# Altium project mapaSensorChassi.PrjPCB
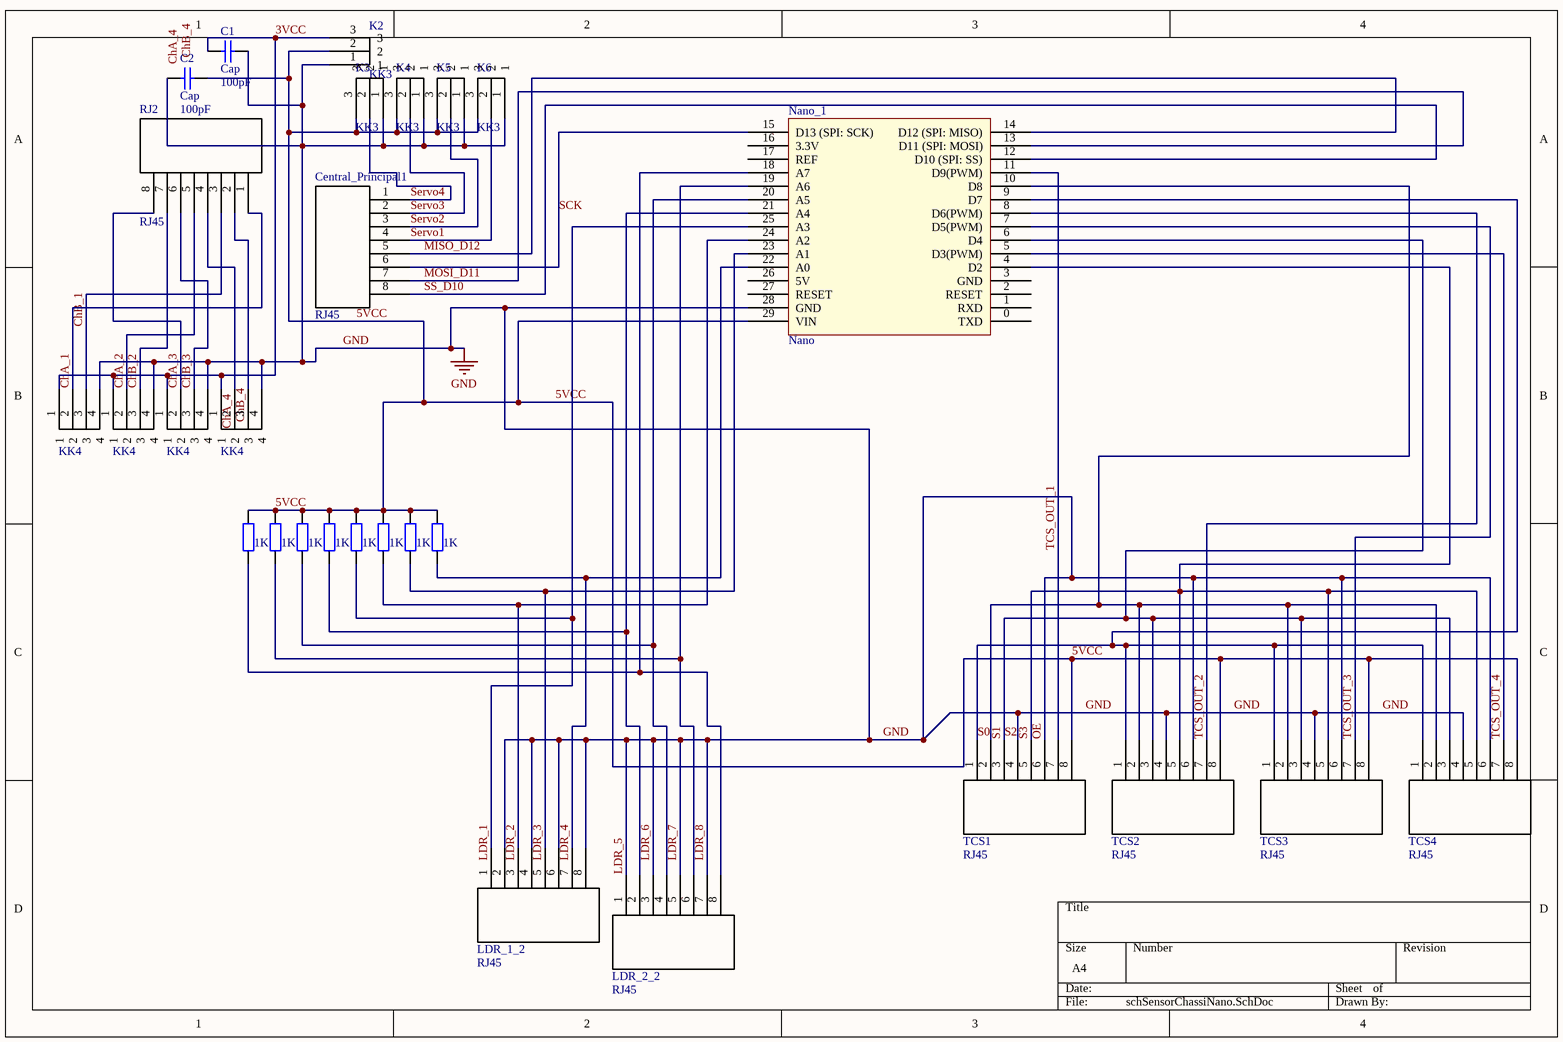
[diagram p0: schSensorChassiNano.SchDoc]
4 sheets, 110 parts. Net scope: global (net labels, ports and power ports of the same name join across sheets).
Board files: pcbSensorChassiNano.PcbDoc, pcbGarra.PcbDoc, pcbChaves.PcbDoc
Sheets:
  schSensorChassiNano.SchDoc
  schBeagleBone.SchDoc
  schGarra.SchDoc
  schChaves.SchDoc

## Sheet schSensorChassiNano.SchDoc
size A4

### Parts
C1  Cap  value 100pF  [RAD-0.3]
C2  Cap  value 100pF  [RAD-0.3]
Central_Principal1  RJ45  [RJ45_90]
Encoder_4  KK4  [4-vias]
Encoder_5  KK4  [4-vias]
Encoder_6  KK4  [4-vias]
K1  KK4  [4-vias]
K2  KK3  [3-vias]
K3  KK3  [3-vias]
K4  KK3  [3-vias]
K5  KK3  [3-vias]
K6  KK3  [3-vias]
LDR_1_2  RJ45  [RJ45_90]
LDR_2_2  RJ45  [RJ45_90]
Nano_1  Nano  [Arduino_Nano]
R17  value 1K  [AXIAL-0.4]  (hidden comment: Res2)
R18  value 1K  [AXIAL-0.4]  (hidden comment: Res2)
R19  value 1K  [AXIAL-0.4]  (hidden comment: Res2)
R20  value 1K  [AXIAL-0.4]  (hidden comment: Res2)
R21  value 1K  [AXIAL-0.4]  (hidden comment: Res2)
R22  value 1K  [AXIAL-0.4]  (hidden comment: Res2)
R23  value 1K  [AXIAL-0.4]  (hidden comment: Res2)
R24  value 1K  [AXIAL-0.4]  (hidden comment: Res2)
RJ2  RJ45  [RJ45_90]
TCS1  RJ45  [RJ45_90]
TCS2  RJ45  [RJ45_90]
TCS3  RJ45  [RJ45_90]
TCS4  RJ45  [RJ45_90]

### Nets
GND: C1.2 C2.1 Encoder_4.4 Encoder_5.4 Encoder_6.4 K1.4 K2.1 K3.1 K4.1 K5.1 K6.1 LDR_1_2.2 LDR_1_2.4 LDR_1_2.6 LDR_1_2.8 LDR_2_2.1 LDR_2_2.3 LDR_2_2.5 LDR_2_2.7 Nano_1.28(GND) TCS1.4 TCS1.6 TCS2.4 TCS2.6 TCS3.4 TCS3.6 TCS4.4 TCS4.6  [also labelled LDR_5, LDR_6, LDR_7, LDR_8, OE]  [project net 12V]
3VCC: C1.1 Encoder_4.1 Encoder_5.1 Encoder_6.1 K1.1 K2.3
5VCC: C2.2 K2.2 K3.3 K4.3 K5.3 K6.3 Nano_1.29(VIN) R17.2 R18.2 R19.2 R20.2 R21.2 R22.2 R23.2 R24.2 TCS1.8 TCS2.8 TCS3.8 TCS4.8
ChA_1: K1.2 RJ2.1
ChA_2: Encoder_4.2 RJ2.5
ChA_3: Encoder_5.2 RJ2.8
ChB_1: K1.3 RJ2.3
ChB_2: Encoder_4.3 RJ2.7
ChB_3: Encoder_5.3 RJ2.6
MISO_D12: Central_Principal1.5 Nano_1.14(D12_(SPI:_MISO))
MOSI_D11: Central_Principal1.7 Nano_1.13(D11_(SPI:_MOSI))
S0: Nano_1.9(D7) TCS1.1 TCS2.1 TCS3.1 TCS4.1
S1: Nano_1.6(D4) TCS1.3 TCS2.3 TCS3.3 TCS4.3  [also labelled S2]
S3: Nano_1.4(D2) TCS1.5 TCS2.5 TCS3.5 TCS4.5
SCK: Central_Principal1.6 Nano_1.15(D13_(SPI:_SCK))
Servo1: Central_Principal1.4 K6.2
Servo2: Central_Principal1.3 K5.2
Servo3: Central_Principal1.2 K4.2
Servo4: Central_Principal1.1 K3.2
SS_D10: Central_Principal1.8 Nano_1.12(D10_(SPI:_SS))
TCS_OUT_1: Nano_1.11(D9(PWM)) TCS1.7
TCS_OUT_2: Nano_1.8(D6(PWM)) TCS2.7
TCS_OUT_3: Nano_1.7(D5(PWM)) TCS3.7
TCS_OUT_4: Nano_1.5(D3(PWM)) TCS4.7
NetEncoder_6_2: Encoder_6.2 RJ2.4
NetEncoder_6_3: Encoder_6.3 RJ2.2
NetLDR_1_2_1: LDR_1_2.1 Nano_1.25(A3) R21.1
NetLDR_1_2_3: LDR_1_2.3 Nano_1.24(A2) R22.1
NetLDR_1_2_5: LDR_1_2.5 Nano_1.23(A1) R23.1
NetLDR_1_2_7: LDR_1_2.7 Nano_1.22(A0) R24.1
NetLDR_2_2_2: LDR_2_2.2 Nano_1.21(A4) R20.1
NetLDR_2_2_4: LDR_2_2.4 Nano_1.20(A5) R19.1
NetLDR_2_2_6: LDR_2_2.6 Nano_1.19(A6) R18.1
NetLDR_2_2_8: LDR_2_2.8 Nano_1.18(A7) R17.1
NetNano_1_10: Nano_1.10(D8) TCS1.2 TCS2.2 TCS3.2 TCS4.2

Not connected (* = marked no-connect by the designer): Nano_1 0(TXD) 1(RXD) 2(RESET) 3(GND) 16(3.3V) 17(REF) 26(5V) 27(RESET)

### Notes on the sheet
- Labels drawn without touching a wire or pin: ChA_4, ChB_4, LDR_1, LDR_2, LDR_3, LDR_4

### Library data of the parts
C1 C2 = Cap: Capacitor; Published: 8-Jun-2000; LatestRevisionDate: 17-Jul-2002; LatestRevisionNote: Re-released for DXP Platform.; PackageReference: RAD-0.3; Publisher: Altium Limited; PackageDescription: Radial Cap, Thru-Hole; 2 Leads; 0.3 in Pin Spacing
Encoder_4-Encoder_6 K1 = KK4Vias: ComponentLink1Description: Fabricante; ComponentLink1URL: https://www.molex.com/molex/products/family?key=kk_254_rpc_connector_system&channel=products&chanName=family&pageTitle=Introduction&parentKey=kk_interconnect_solutions
K2-K6 = KK3Vias
Nano_1 = Arduino_Nano
R17-R24 = Res2: Resistor; Published: 8-Jun-2000; LatestRevisionDate: 17-Jul-2002; LatestRevisionNote: Re-released for DXP Platform.; PackageReference: AXIAL-0.4; Publisher: Altium Limited; PackageDescription: Axial Device, Thru-Hole; 2 Leads; 0.4 in Pin Spacing

## Sheet schBeagleBone.SchDoc
size A4
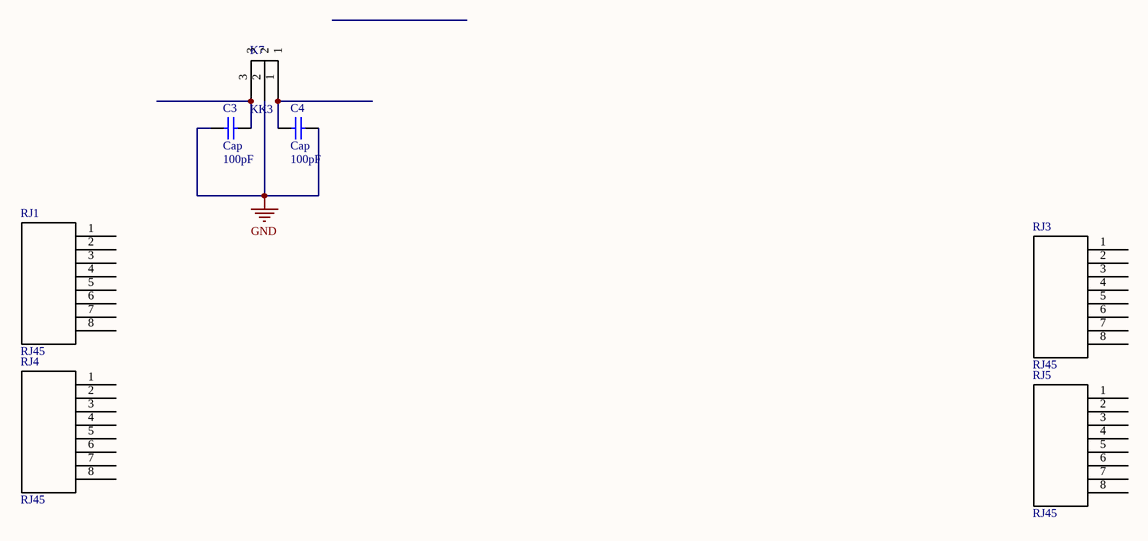
[diagram p1: schBeagleBone.SchDoc]

### Parts
C3  Cap  value 100pF  [RAD-0.3]
C4  Cap  value 100pF  [RAD-0.3]
K7  KK3  [3-vias]
RJ1  RJ45  [RJ45_90]
RJ3  RJ45  [RJ45_Simples]
RJ4  RJ45  [RJ45_90]
RJ5  RJ45  [RJ45_Simples]

### Nets
GND: C3.1 C4.2 K7.2  [project net 12V]
NetC3_2: C3.2 K7.3
NetC4_1: C4.1 K7.1

Not connected (* = marked no-connect by the designer): RJ1 1(9) 2 3 4 5 6 7 8; RJ3 1(9) 2 3 4 5 6 7 8; RJ4 1(9) 2 3 4 5 6 7 8; RJ5 1(9) 2 3 4 5 6 7 8

### Library data of the parts
C3 C4 = Cap: Capacitor; Published: 8-Jun-2000; LatestRevisionDate: 17-Jul-2002; LatestRevisionNote: Re-released for DXP Platform.; PackageReference: RAD-0.3; Publisher: Altium Limited; PackageDescription: Radial Cap, Thru-Hole; 2 Leads; 0.3 in Pin Spacing
K7 = KK3Vias
RJ1 RJ4 = RJ45_90

## Sheet schGarra.SchDoc
size A4
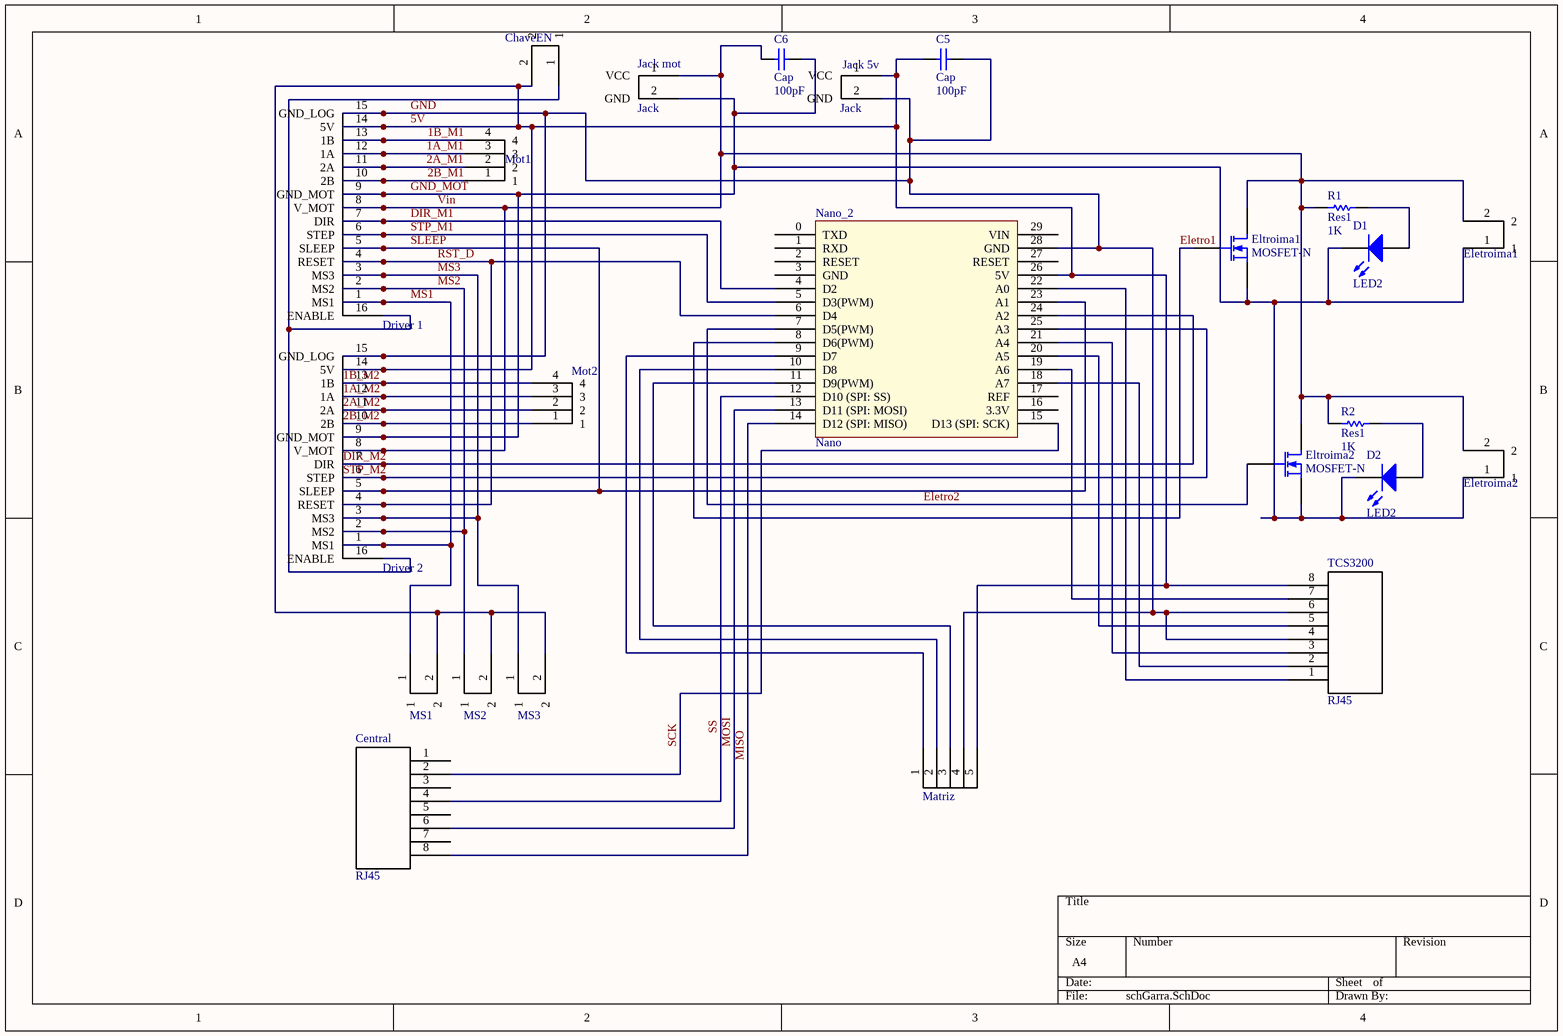
[diagram p2: schGarra.SchDoc]

### Parts
C5  Cap  value 100pF  [RAD-0.3]
C6  Cap  value 100pF  [RAD-0.3]
Central  RJ45  [RJ45_Simples]
ChaveEN  KK2  [2-vias]  (value not drawn)
D1  LED2  [2-vias]
D2  LED2  [2-vias]
Driver_1  A4988  [A4988]  (value not drawn)
Driver_2  A4988  [A4988]  (value not drawn)
Eletroima1  KK2  [2-vias]  (value not drawn)
Eletroima2  KK2  [2-vias]  (value not drawn)
Eltroima1  MOSFET-N  [3-vias]
Eltroima2  MOSFET-N  [3-vias]
Jack_5v  Jack  [JACK J4]
Jack_mot  Jack  [JACK J4]
Matriz  JTS-XH (5T)  [JTS-XH (5T)]  (value not drawn)
Mot1  KK4  [4-vias]  (value not drawn)
Mot2  KK4  [4-vias]  (value not drawn)
MS1  KK2  [2-vias]  (value not drawn)
MS2  KK2  [2-vias]  (value not drawn)
MS3  KK2  [2-vias]  (value not drawn)
Nano_2  Nano  [Arduino_Nano]
R1  Res1  value 1K  [AXIAL-0.3]
R2  Res1  value 1K  [AXIAL-0.3]
TCS3200  RJ45  [RJ45_Simples]

### Nets
GND: C5.2 Driver_1.15(GND_LOG) Driver_2.15(GND_LOG) Jack_5v.2(GND) Matriz.4 Nano_2.28(GND) TCS3200.4 TCS3200.6  [project net 12V]
1A_M1: Driver_1.12(1A) Mot1.3
1A_M2: Driver_2.12(1A) Mot2.3
1B_M1: Driver_1.13(1B) Mot1.4
1B_M2: Driver_2.13(1B) Mot2.4
2A_M1: Driver_1.11(2A) Mot1.2
2A_M2: Driver_2.11(2A) Mot2.2
2B_M1: Driver_1.10(2B) Mot1.1
2B_M2: Driver_2.10(2B) Mot2.1
5V: C5.1 ChaveEN.2 Driver_1.14(5V) Driver_2.14(5V) Jack_5v.1(VCC) Matriz.5 MS1.2 MS2.2 MS3.2 Nano_2.26(5V) TCS3200.8
DIR_M1: Driver_1.7(DIR) Nano_2.4(D2)
DIR_M2: Driver_2.7(DIR) Nano_2.24(A2)
Eletro1: Eltroima1.2(G) Nano_2.8(D6(PWM))
Eletro2: Eltroima2.2(G) Nano_2.7(D5(PWM))
GND_MOT: C6.2 D1.2(K) D2.2(K) Driver_1.9(GND_MOT) Driver_2.9(GND_MOT) Eletroima1.1 Eletroima2.1 Eltroima1.3(S) Eltroima2.3(S) Jack_mot.2(GND)
MISO: Central.8 Nano_2.14(D12_(SPI:_MISO))
MOSI: Central.6 Nano_2.13(D11_(SPI:_MOSI))
MS1: Driver_1.1(MS1) Driver_2.1(MS1) MS1.1
MS2: Driver_1.2(MS2) Driver_2.2(MS2) MS2.1
MS3: Driver_1.3(MS3) Driver_2.3(MS3) MS3.1
RST_D: Driver_1.4(RESET) Driver_2.4(RESET) Nano_2.6(D4)
SCK: Central.2 Nano_2.15(D13_(SPI:_SCK))
SLEEP: Driver_1.5(SLEEP) Driver_2.5(SLEEP) Nano_2.23(A1)
SS: Central.4 Nano_2.12(D10_(SPI:_SS))
STP_M1: Driver_1.6(STEP) Nano_2.5(D3(PWM))
STP_M2: Driver_2.6(STEP) Nano_2.25(A3)
Vin: C6.1 Driver_1.8(V_MOT) Driver_2.8(V_MOT) Eletroima1.2 Eletroima2.2 Eltroima1.1(D) Eltroima2.1(D) Jack_mot.1(VCC) R1.2 R2.1
NetChaveEN_1: ChaveEN.1 Driver_1.16(ENABLE) Driver_2.16(ENABLE)
NetD1_1: D1.1(A) R1.1
NetD2_1: D2.1(A) R2.2
NetMatriz_1: Matriz.1 Nano_2.9(D7)
NetMatriz_2: Matriz.2 Nano_2.10(D8)
NetMatriz_3: Matriz.3 Nano_2.11(D9(PWM))
NetNano_2_18: Nano_2.18(A7) TCS3200.2
NetNano_2_19: Nano_2.19(A6) TCS3200.7
NetNano_2_20: Nano_2.20(A5) TCS3200.5
NetNano_2_21: Nano_2.21(A4) TCS3200.3
NetNano_2_22: Nano_2.22(A0) TCS3200.1

Not connected (* = marked no-connect by the designer): Central 1(9) 3 5 7; Nano_2 0(TXD) 1(RXD) 2(RESET) 3(GND) 16(3.3V) 17(REF) 27(RESET) 29(VIN)

### Library data of the parts
C5 C6 = Cap: Capacitor; Published: 8-Jun-2000; LatestRevisionDate: 17-Jul-2002; LatestRevisionNote: Re-released for DXP Platform.; PackageReference: RAD-0.3; Publisher: Altium Limited; PackageDescription: Radial Cap, Thru-Hole; 2 Leads; 0.3 in Pin Spacing
ChaveEN Eletroima1 Eletroima2 MS1-MS3 = KK2Vias
D1 D2 = LED2: Typical RED, GREEN, YELLOW, AMBER GaAs LED; Published: 8-Jun-2000; LatestRevisionDate: 17-Jul-2002; LatestRevisionNote: Re-released for DXP Platform.; PackageVersion: Feb-2002; PackageReference: 3.2X1.6X1.1; Publisher: Altium Limited; PackageDescription: SM LED; 2 Flat Leads
Eltroima1 Eltroima2 = MOSFET-N: N-Channel MOSFET; Published: 8-Jun-2000; LatestRevisionDate: 17-Jul-2002; LatestRevisionNote: Re-released for DXP Platform.; PackageVersion: 1995/1996; PackageReference: E3; Publisher: Altium Limited; PackageDescription: TO, Flat Index; 3 In-Line, Axial Leads; Body Dia. 4.6mm; Lead Dia. 0.5 mm (max)
Mot1 Mot2 = KK4Vias: ComponentLink1Description: Fabricante; ComponentLink1URL: https://www.molex.com/molex/products/family?key=kk_254_rpc_connector_system&channel=products&chanName=family&pageTitle=Introduction&parentKey=kk_interconnect_solutions
Nano_2 = Arduino_Nano
R1 R2 = Res1: Resistor; Published: 8-Jun-2000; LatestRevisionDate: 17-Jul-2002; LatestRevisionNote: Re-released for DXP Platform.; PackageReference: AXIAL-0.3; Publisher: Altium Limited; PackageDescription: Axial Device, Thru-Hole; 2 Leads; 0.3 in Pin Spacing

## Sheet schChaves.SchDoc
size A4
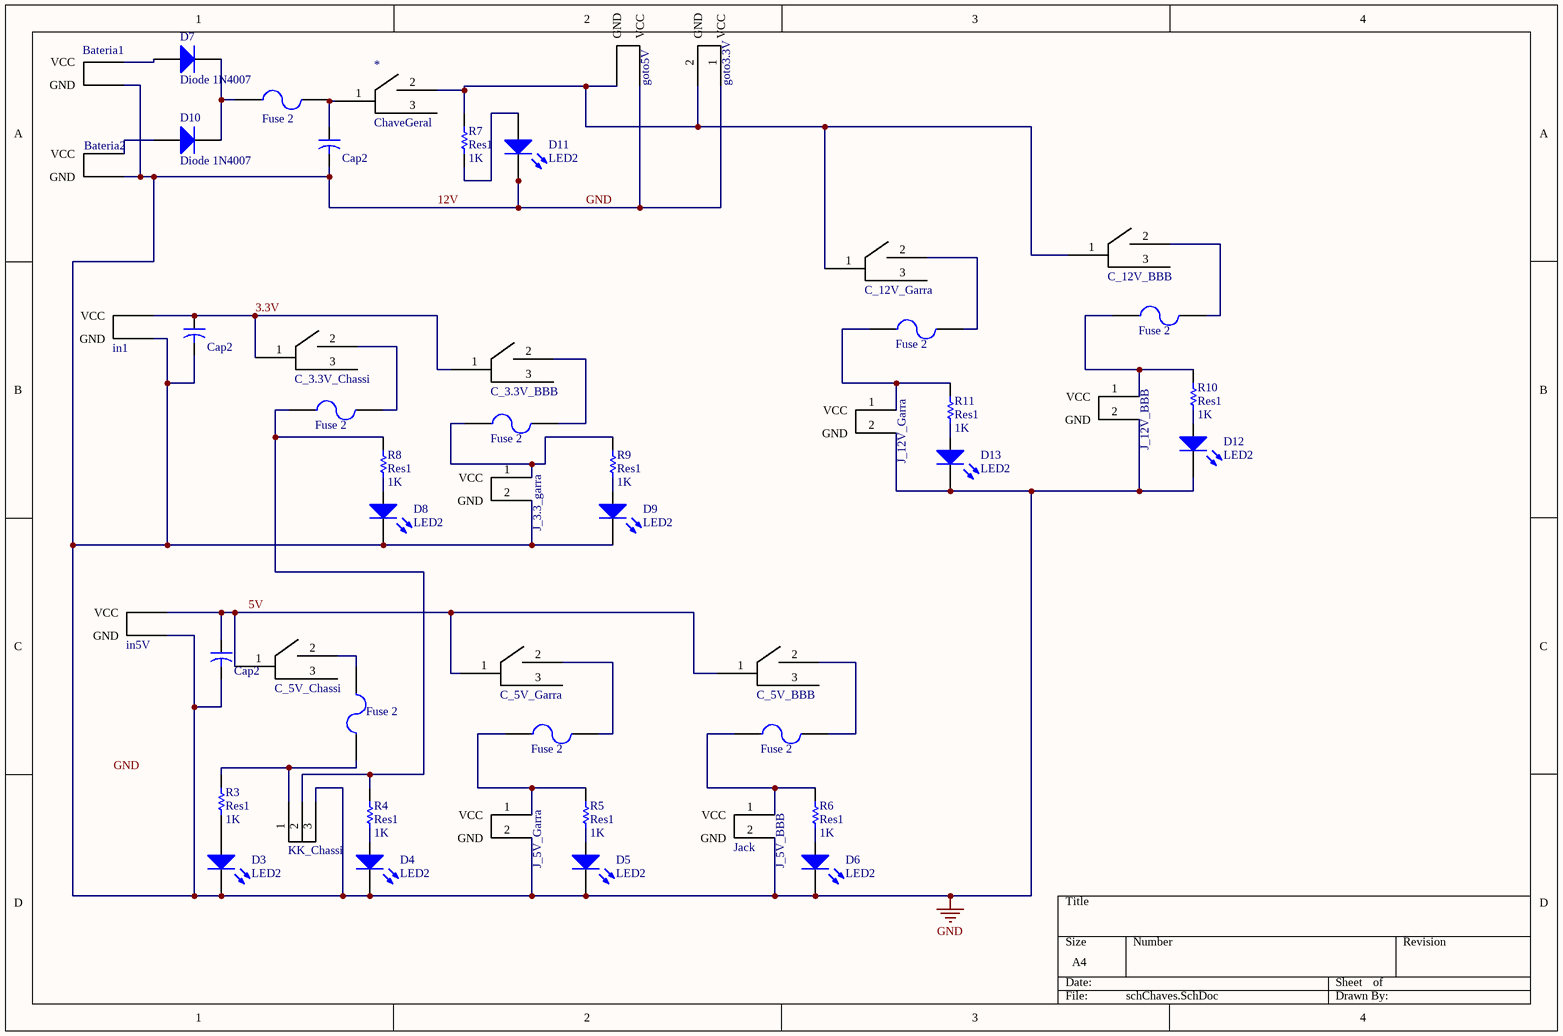
[diagram p3: schChaves.SchDoc]

### Parts
*  ChaveGeral  [Chave]
Bateria1  Jack  [JACK J4]  (value not drawn)
Bateria2  Jack  [JACK J4]  (value not drawn)
C_3.3V_BBB  Chave  [Chave]  (value not drawn)
C_3.3V_Chassi  Chave  [Chave]  (value not drawn)
C_5V_BBB  Chave  [Chave]  (value not drawn)
C_5V_Chassi  Chave  [Chave]  (value not drawn)
C_5V_Garra  Chave  [Chave]  (value not drawn)
C_12V_BBB  Chave  [Chave]  (value not drawn)
C_12V_Garra  Chave  [Chave]  (value not drawn)
C_parrudo  Cap2  [CAPR5-4X5]
C_parrudo1  Cap2  [CAPR5-4X5]
C_parrudo2  Cap2  [CAPR5-4X5]
D3  LED2  [2-vias]
D4  LED2  [2-vias]
D5  LED2  [2-vias]
D6  LED2  [2-vias]
D7  Diode 1N4007  [DO-41]
D8  LED2  [2-vias]
D9  LED2  [2-vias]
D10  Diode 1N4007  [DO-41]
D11  LED2  [2-vias]
D12  LED2  [2-vias]
D13  LED2  [2-vias]
F1  Fuse 2  [AXIAL-0.9]
F2  Fuse 2  [AXIAL-0.9]
F3  Fuse 2  [AXIAL-0.9]
F4  Fuse 2  [AXIAL-0.9]
F5  Fuse 2  [AXIAL-0.9]
F6  Fuse 2  [AXIAL-0.9]
F7  Fuse 2  [AXIAL-0.9]
F8  Fuse 2  [AXIAL-0.9]
goto3.3V  Jack  [JACK J4]  (value not drawn)
goto5V  Jack  [JACK J4]  (value not drawn)
in1  Jack  [JACK J4]  (value not drawn)
in5V  Jack  [JACK J4]  (value not drawn)
J_3.3_garra  Jack  [JACK J4]  (value not drawn)
J_5V_BBB  Jack  [JACK J4]
J_5V_Garra  Jack  [JACK J4]  (value not drawn)
J_12V_BBB  Jack  [JACK J4]  (value not drawn)
J_12V_Garra  Jack  [JACK J4]  (value not drawn)
KK_Chassi  KK3  [3-vias]  (value not drawn)
R3  Res1  value 1K  [AXIAL-0.3]
R4  Res1  value 1K  [AXIAL-0.3]
R5  Res1  value 1K  [AXIAL-0.3]
R6  Res1  value 1K  [AXIAL-0.3]
R7  Res1  value 1K  [AXIAL-0.3]
R8  Res1  value 1K  [AXIAL-0.3]
R9  Res1  value 1K  [AXIAL-0.3]
R10  Res1  value 1K  [AXIAL-0.3]
R11  Res1  value 1K  [AXIAL-0.3]

### Nets
12V: Bateria1.2(GND) Bateria2.2(GND) C_parrudo.2 C_parrudo1.2 C_parrudo2.2 D3.2(K) D4.2(K) D5.2(K) D6.2(K) D8.2(K) D9.2(K) D11.2(K) D12.2(K) D13.2(K) goto3.3V.1(VCC) goto5V.1(VCC) in1.2(GND) in5V.2(GND) J_3.3_garra.2(GND) J_5V_BBB.2(GND) J_5V_Garra.2(GND) J_12V_BBB.2(GND) J_12V_Garra.2(GND) KK_Chassi.3  [also labelled GND]
3.3V: C_3.3V_BBB.1(Comum) C_3.3V_Chassi.1(Comum) C_parrudo1.1 in1.1(VCC)
5V: C_5V_BBB.1(Comum) C_5V_Chassi.1(Comum) C_5V_Garra.1(Comum) C_parrudo2.1 in5V.1(VCC)
Net*_1: *.1(Comum) C_parrudo.1 F1.2
Net*_2: *.2(N.A.) C_12V_BBB.1(Comum) C_12V_Garra.1(Comum) goto3.3V.2(GND) goto5V.2(GND) R7.2
NetBateria1_1: Bateria1.1(VCC) D7.1(A)
NetBateria2_1: Bateria2.1(VCC) D10.1(A)
NetC_3.3V_BBB_2: C_3.3V_BBB.2(N.A.) F3.2
NetC_3.3V_Chassi_2: C_3.3V_Chassi.2(N.A.) F2.2
NetC_5V_BBB_2: C_5V_BBB.2(N.A.) F6.2
NetC_5V_Chassi_2: C_5V_Chassi.2(N.A.) F4.1
NetC_5V_Garra_2: C_5V_Garra.2(N.A.) F5.2
NetC_12V_BBB_2: C_12V_BBB.2(N.A.) F7.2
NetC_12V_Garra_2: C_12V_Garra.2(N.A.) F8.2
NetD3_1: D3.1(A) R3.1
NetD4_1: D4.1(A) R4.1
NetD5_1: D5.1(A) R5.1
NetD6_1: D6.1(A) R6.1
NetD7_2: D7.2(K) D10.2(K) F1.1
NetD8_1: D8.1(A) R8.1
NetD9_1: D9.1(A) R9.1
NetD11_1: D11.1(A) R7.1
NetD12_1: D12.1(A) R10.1
NetD13_1: D13.1(A) R11.1
NetF2_1: F2.1 KK_Chassi.2 R4.2 R8.2
NetF3_1: F3.1 J_3.3_garra.1(VCC) R9.2
NetF4_2: F4.2 KK_Chassi.1 R3.2
NetF5_1: F5.1 J_5V_Garra.1(VCC) R5.2
NetF6_1: F6.1 J_5V_BBB.1(VCC) R6.2
NetF7_1: F7.1 J_12V_BBB.1(VCC) R10.2
NetF8_1: F8.1 J_12V_Garra.1(VCC) R11.2

Not connected (* = marked no-connect by the designer): * 3(N.F); C_3.3V_BBB 3(N.F); C_3.3V_Chassi 3(N.F); C_5V_BBB 3(N.F); C_5V_Chassi 3(N.F); C_5V_Garra 3(N.F); C_12V_BBB 3(N.F); C_12V_Garra 3(N.F)

### Notes on the sheet
- Labels drawn without touching a wire or pin: GND

### Library data of the parts
* = Chave
C_parrudo C_parrudo1 C_parrudo2 = Cap2: Capacitor; Value: 100pF; Published: 23-Sep-2002; PackageReference: CAPR5-4X5; Publisher: Altium Limited; PackageDescription: Capacitor; 2 Leads
D3-D6 D8 D9 D11-D13 = LED2: as D1 on sheet schGarra; Published: 8-Jun-2000; LatestRevisionDate: 17-Jul-2002; LatestRevisionNote: Re-released for DXP Platform.; PackageVersion: Feb-2002; PackageReference: 3.2X1.6X1.1; Publisher: Altium Limited; PackageDescription: SM LED; 2 Flat Leads
D7 D10 = Diode 1N4007: 1 Amp General Purpose Rectifier; Published: 8-Jun-2000; LatestRevisionDate: 17-Jul-2002; LatestRevisionNote: Re-released for DXP Platform.; DatasheetVersion: 1998; PackageVersion: Aug-1999; PackageReference: DO-41; Publisher: Altium Limited; PackageDescription: Diode, Axial; Body 5.2 x 2.7 mm (LxDia. max), Lead Dia. 0.86 mm (max); Code_JEDEC: DO-204-AL; ComponentLink1Description: Manufacturer Link; ComponentLink1URL: http://www.fairchildsemi.com/; ComponentLink2Description: Datasheet; ComponentLink2URL: http://www.fairchildsemi.com/ds/1N%2F1N4001.pdf
F1-F8 = Fuse 2: Fuse; Published: 8-Jun-2000; LatestRevisionDate: 17-Jul-2002; LatestRevisionNote: Re-released for DXP Platform.; PackageReference: PIN-W2/E2.8; Publisher: Altium Limited; PackageDescription: Thru-Hole; 2 Leads
KK_Chassi = KK3Vias
R3-R11 = Res1: Resistor; Published: 8-Jun-2000; LatestRevisionDate: 17-Jul-2002; LatestRevisionNote: Re-released for DXP Platform.; PackageReference: AXIAL-0.3; Publisher: Altium Limited; PackageDescription: Axial Device, Thru-Hole; 2 Leads; 0.3 in Pin Spacing

## Nets that join several sheets
12V: schSensorChassiNano (28 pins), schBeagleBone (C3.1 C4.2 K7.2), schGarra (8 pins), schChaves (24 pins)
5V: schGarra (11 pins), schChaves (5 pins)
SCK: schSensorChassiNano (Central_Principal1.6 Nano_1.15), schGarra (Central.2 Nano_2.15)